# Altium schematic sheet Dribble.SchDoc
size A4
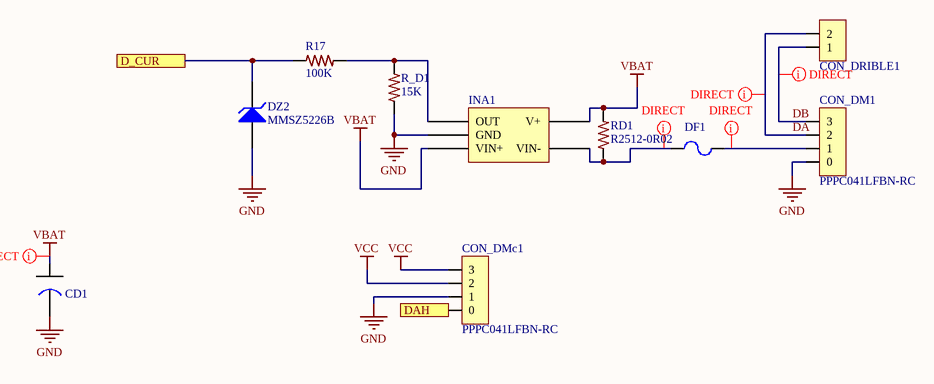
[diagram p0: Dribble.SchDoc]

## Parts
CD1  EEE-FK1C681GP  [EEE-FK1C681GP]  (value not drawn)
CON_DM1  PPPC041LFBN-RC  [04x01_Conector_Female - duplicate]
CON_DMc1  PPPC041LFBN-RC  [04x01_Conector_Female - duplicate]
CON_DRIBLE1  0022112022  [02x01_Conector_Male]  (value not drawn)
DF1  MF-MSMF250/16X  [RESC4632X16N]  (value not drawn)
DZ2  MMSZ5226B  [FAIR-SOD-123-2_V]
INA1  INA169NA  [SOT95P280X125-5N]  (value not drawn)
R17  100K  [0402-RES-HD]
R_D1  15K  [0402-RES-HD]
RD1  R2512-0R02  [2512-RES-HD]

## Ports
D_CUR, DAH

## Nets
GND: CD1.2 CON_DM1.0 CON_DMc1.1 DZ2.1(A) INA1.2(GND) R_D1.1
VBAT: CD1.1 INA1.3(VIN+) INA1.4(V+) RD1.2
VCC: CON_DMc1.2 CON_DMc1.3
D_CUR: DZ2.2(K) R17.2 ; port D_CUR
DA: CON_DM1.2 CON_DRIBLE1.2
DAH: CON_DMc1.0 ; port DAH
DB: CON_DM1.3 CON_DRIBLE1.1
NetCON_DM1_1: CON_DM1.1 DF1.1
NetDF1_2: DF1.2 INA1.5(VIN-) RD1.1
NetINA1_1: INA1.1(OUT) R17.1 R_D1.2

## Layout directives
net class DIRECT: DA, DB, NetCON_DM1_1, NetDF1_2, VBAT

## Library data of the parts
CD1 = CAP AL 680UF/16V: Aluminum Electrolytic Capacitors - SMD Al Lytic Cap SMT FK Series 105C
CON_DM1 CON_DMc1 = 04x01_Conector_Female-SCH: 4 Position Header Connector 0.100" (2.54mm) Through Hole Gold
CON_DRIBLE1 = 02x01_Conector_Male: CONN HEADER 2POS .100 VERT GOLD
DF1 = MF-MSMF250/16X-01.A.1: PTC RESETTABLE .30A 30V 1812
DZ2 = CMP-2000-06741-1: Zener Diode, 3.3 V, -55 to 150 degC, 2-Pin SOD-123，RoHS, Tape and Reel; Manufacturer: FairchildSemiconductor; Configuration: Single; Maximum Reverse Leakage Current: 25uA; Zener Voltage Tolerance: 5%; Rad Hard: No; Maximum Power Dissipation: 500mW; Nominal Zener Voltage: 3.3V; Mounting: SurfaceMount; Datasheet Version: Rev. 1.6, 10/2015; Operating Temperature: -55to150°C; Category: Zener; Package: 2SOD-123; Package Reference: SOD-123-2; Datasheet URL: https://www.fairchildsemi.com/datasheets/MM/MMSZ5226B.pdf; Packaging: Tape&Reel; Mounting Technology: SurfaceMount; Package Description: 2-Pin Surface Mount Device, Body 2.7 x 1.6 mm; Manufacturer URL: https://www.fairchildsemi.com/
INA1 = INA169NA-01.A.1: IC CURRENT MONITOR 0.5% SOT23-5
R17 R_D1 = R0402-1K-A.9: RES 1K OHM 1/10W 1% 0402 SMD; Part No: ERJ-2RKF1001X; Cod EMS: 05.280.029.527; Family Description: RESISTOR FILME ESPESSO 10R-1M / 1/10W / 1% / 0402. P/N: ERJ-2RKF....X – PANASONIC ELECTRONIC COMPONENTS.; Value: 1K; Family: ERJ-2RKF....X
RD1 = R2512-0R02-4: RES .02 OHM 2W 1% 2512 SMD; Part No: WSL2512R0200FEA18; Cod EMS: 05.280.029.529; Value: 0.02; Family Description: RESISTOR SENTIDO DE CORRENTE 0,010R-0,040R/ 2W / 1% / 2512 P/N: WSL2512.....FEA18 – VISHAY DALE.; Family: WSL2512.....FEA18